# Altium schematic sheet Main.SchDoc: Linefollower-Main
size A3; Author: Patryk Bujak; DrawnBy: Patryk Bujak; DocumentNumber: 12; Revision: 1.0; SheetNumber: 1; SheetTotal: 10
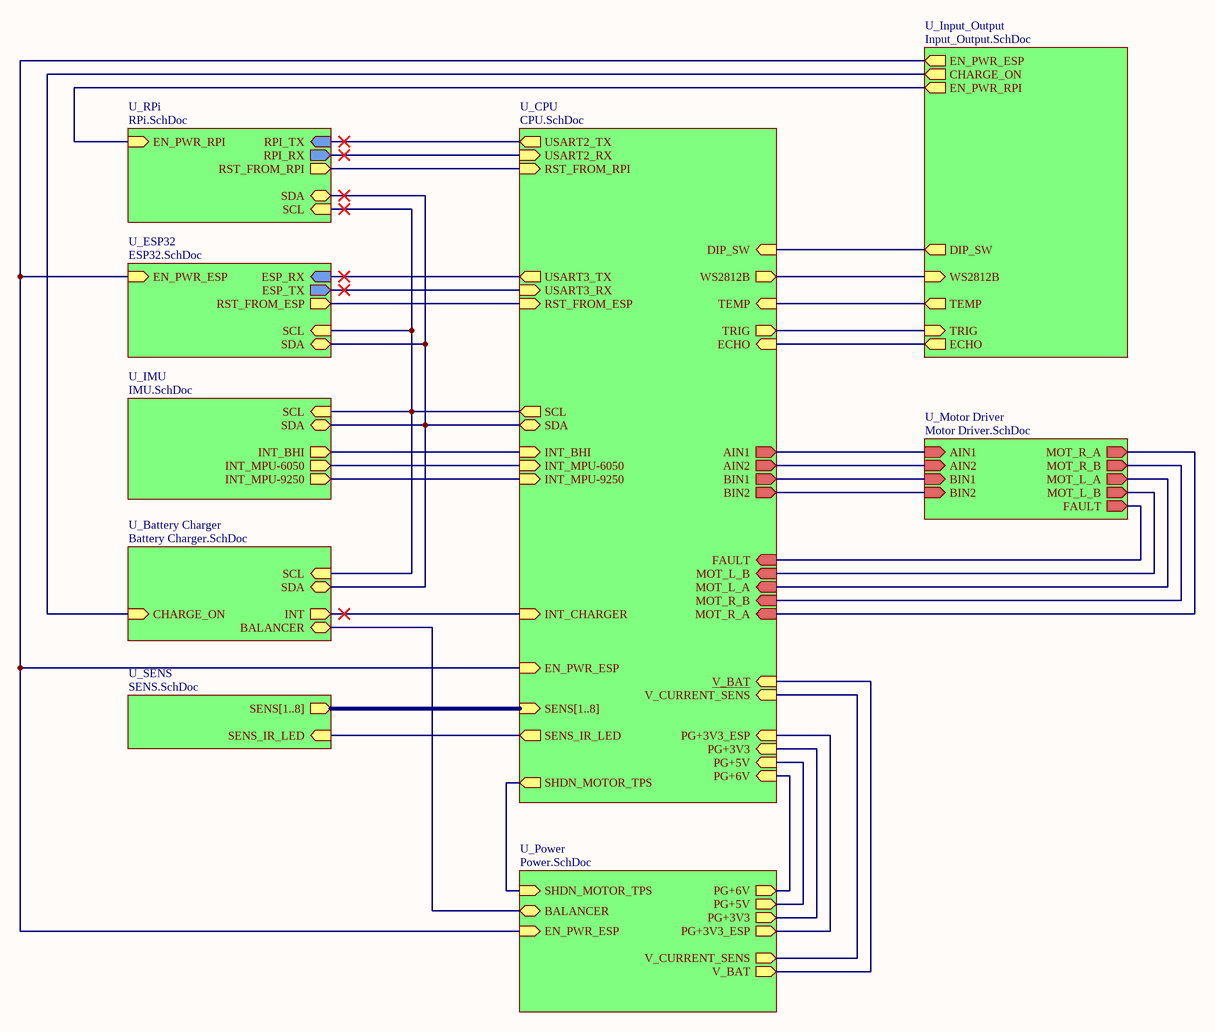
[diagram p0: Main.SchDoc]

## Sub-sheets
U_Battery Charger = Battery Charger.SchDoc: SDA (bidir), SCL (in), CHARGE_ON (in), INT (out), BALANCER (bidir)
U_CPU = CPU.SchDoc: SENS[1..8] (in), SCL (out), SDA (bidir), INT_BHI (in), INT_MPU-9250 (in), INT_MPU-6050 (in), AIN2 (out), AIN1 (out), BIN1 (out), BIN2 (out), FAULT (in), MOT_R_B (in), MOT_R_A (in), MOT_L_B (in), MOT_L_A (in), SHDN_MOTOR_TPS (out), PG+3V3_ESP (in), PG+6V (in), PG+5V (in), PG+3V3 (in), SENS_IR_LED (out), TRIG (out), ECHO (in), TEMP (in), WS2812B (out), DIP_SW (in), V_CURRENT_SENS (in), V_BAT (in), EN_PWR_ESP (in), INT_CHARGER (in), RST_FROM_ESP (in), RST_FROM_RPI (in), USART2_TX (out), USART2_RX (in), USART3_RX (in), USART3_TX (out)
U_ESP32 = ESP32.SchDoc: ESP_TX (out), ESP_RX (in), EN_PWR_ESP (in), SDA (bidir), SCL (in), RST_FROM_ESP (out)
U_IMU = IMU.SchDoc: INT_BHI (out), INT_MPU-9250 (out), INT_MPU-6050 (out), SCL (in), SDA (bidir)
U_Input_Output = Input_Output.SchDoc: WS2812B (in), TRIG (in), ECHO (out), TEMP (out), CHARGE_ON (out), DIP_SW (out), EN_PWR_ESP (out), EN_PWR_RPI (out)
U_Motor Driver = Motor Driver.SchDoc: AIN2 (in), AIN1 (in), BIN1 (in), BIN2 (in), FAULT (out), MOT_R_B (out), MOT_R_A (out), MOT_L_B (out), MOT_L_A (out)
U_Power = Power.SchDoc: SHDN_MOTOR_TPS (in), PG+6V (out), PG+5V (out), PG+3V3 (out), PG+3V3_ESP (out), EN_PWR_ESP (in), V_CURRENT_SENS (out), V_BAT (out), BALANCER (bidir)
U_RPi = RPi.SchDoc: RPI_TX (in), RPI_RX (out), SDA (bidir), SCL (in), EN_PWR_RPI (in), RST_FROM_RPI (out)
U_SENS = SENS.SchDoc: SENS[1..8] (out), SENS_IR_LED (in)

## Nets
(unnamed): sheet U_SENS/SENS_IR_LED, sheet U_CPU/SENS_IR_LED
(unnamed): sheet U_Power/SHDN_MOTOR_TPS, sheet U_CPU/SHDN_MOTOR_TPS
(unnamed): sheet U_Power/PG+6V, sheet U_CPU/PG+6V
(unnamed): sheet U_Power/PG+5V, sheet U_CPU/PG+5V
(unnamed): sheet U_Power/PG+3V3, sheet U_CPU/PG+3V3
(unnamed): sheet U_Power/PG+3V3_ESP, sheet U_CPU/PG+3V3_ESP
(unnamed): sheet U_Power/EN_PWR_ESP, sheet U_CPU/EN_PWR_ESP, sheet U_ESP32/EN_PWR_ESP, sheet U_Input_Output/EN_PWR_ESP
(unnamed): sheet U_Power/V_CURRENT_SENS, sheet U_CPU/V_CURRENT_SENS
(unnamed): sheet U_Power/V_BAT, sheet U_CPU/V_BAT
(unnamed): sheet U_Power/BALANCER, sheet U_Battery Charger/BALANCER
(unnamed): sheet U_Motor Driver/AIN2, sheet U_CPU/AIN2
(unnamed): sheet U_Motor Driver/AIN1, sheet U_CPU/AIN1
(unnamed): sheet U_Motor Driver/BIN1, sheet U_CPU/BIN1
(unnamed): sheet U_Motor Driver/BIN2, sheet U_CPU/BIN2
(unnamed): sheet U_Motor Driver/FAULT, sheet U_CPU/FAULT
(unnamed): sheet U_Motor Driver/MOT_R_B, sheet U_CPU/MOT_R_B
(unnamed): sheet U_Motor Driver/MOT_R_A, sheet U_CPU/MOT_R_A
(unnamed): sheet U_Motor Driver/MOT_L_B, sheet U_CPU/MOT_L_B
(unnamed): sheet U_Motor Driver/MOT_L_A, sheet U_CPU/MOT_L_A
(unnamed): sheet U_CPU/SCL, sheet U_IMU/SCL, sheet U_ESP32/SCL, sheet U_RPi/SCL, sheet U_Battery Charger/SCL
(unnamed): sheet U_CPU/SDA, sheet U_IMU/SDA, sheet U_ESP32/SDA, sheet U_RPi/SDA, sheet U_Battery Charger/SDA
(unnamed): sheet U_CPU/INT_BHI, sheet U_IMU/INT_BHI
(unnamed): sheet U_CPU/INT_MPU-9250, sheet U_IMU/INT_MPU-9250
(unnamed): sheet U_CPU/INT_MPU-6050, sheet U_IMU/INT_MPU-6050
(unnamed): sheet U_CPU/TRIG, sheet U_Input_Output/TRIG
(unnamed): sheet U_CPU/ECHO, sheet U_Input_Output/ECHO
(unnamed): sheet U_CPU/TEMP, sheet U_Input_Output/TEMP
(unnamed): sheet U_CPU/WS2812B, sheet U_Input_Output/WS2812B
(unnamed): sheet U_CPU/DIP_SW, sheet U_Input_Output/DIP_SW
(unnamed): sheet U_CPU/INT_CHARGER, sheet U_Battery Charger/INT
(unnamed): sheet U_CPU/RST_FROM_ESP, sheet U_ESP32/RST_FROM_ESP
(unnamed): sheet U_CPU/RST_FROM_RPI, sheet U_RPi/RST_FROM_RPI
(unnamed): sheet U_CPU/USART2_TX, sheet U_RPi/RPI_TX
(unnamed): sheet U_CPU/USART2_RX, sheet U_RPi/RPI_RX
(unnamed): sheet U_CPU/USART3_RX, sheet U_ESP32/ESP_TX
(unnamed): sheet U_CPU/USART3_TX, sheet U_ESP32/ESP_RX
(unnamed): sheet U_RPi/EN_PWR_RPI, sheet U_Input_Output/EN_PWR_RPI
(unnamed): sheet U_Input_Output/CHARGE_ON, sheet U_Battery Charger/CHARGE_ON

## Buses and harness runs
bus sheet U_CPU/SENS[1..8] = sheet U_SENS/SENS[1..8]

## Notes on the sheet
- Title:
- Sheet:
- of
- Author:
- Model:
- Document Number:
- Checked by:
- Iss-Rev:
- Approved by:
- Date:
- File name: